# Altium schematic sheet Sheet1.SchDoc
size A3; SheetNumber: 1; SheetTotal: 1
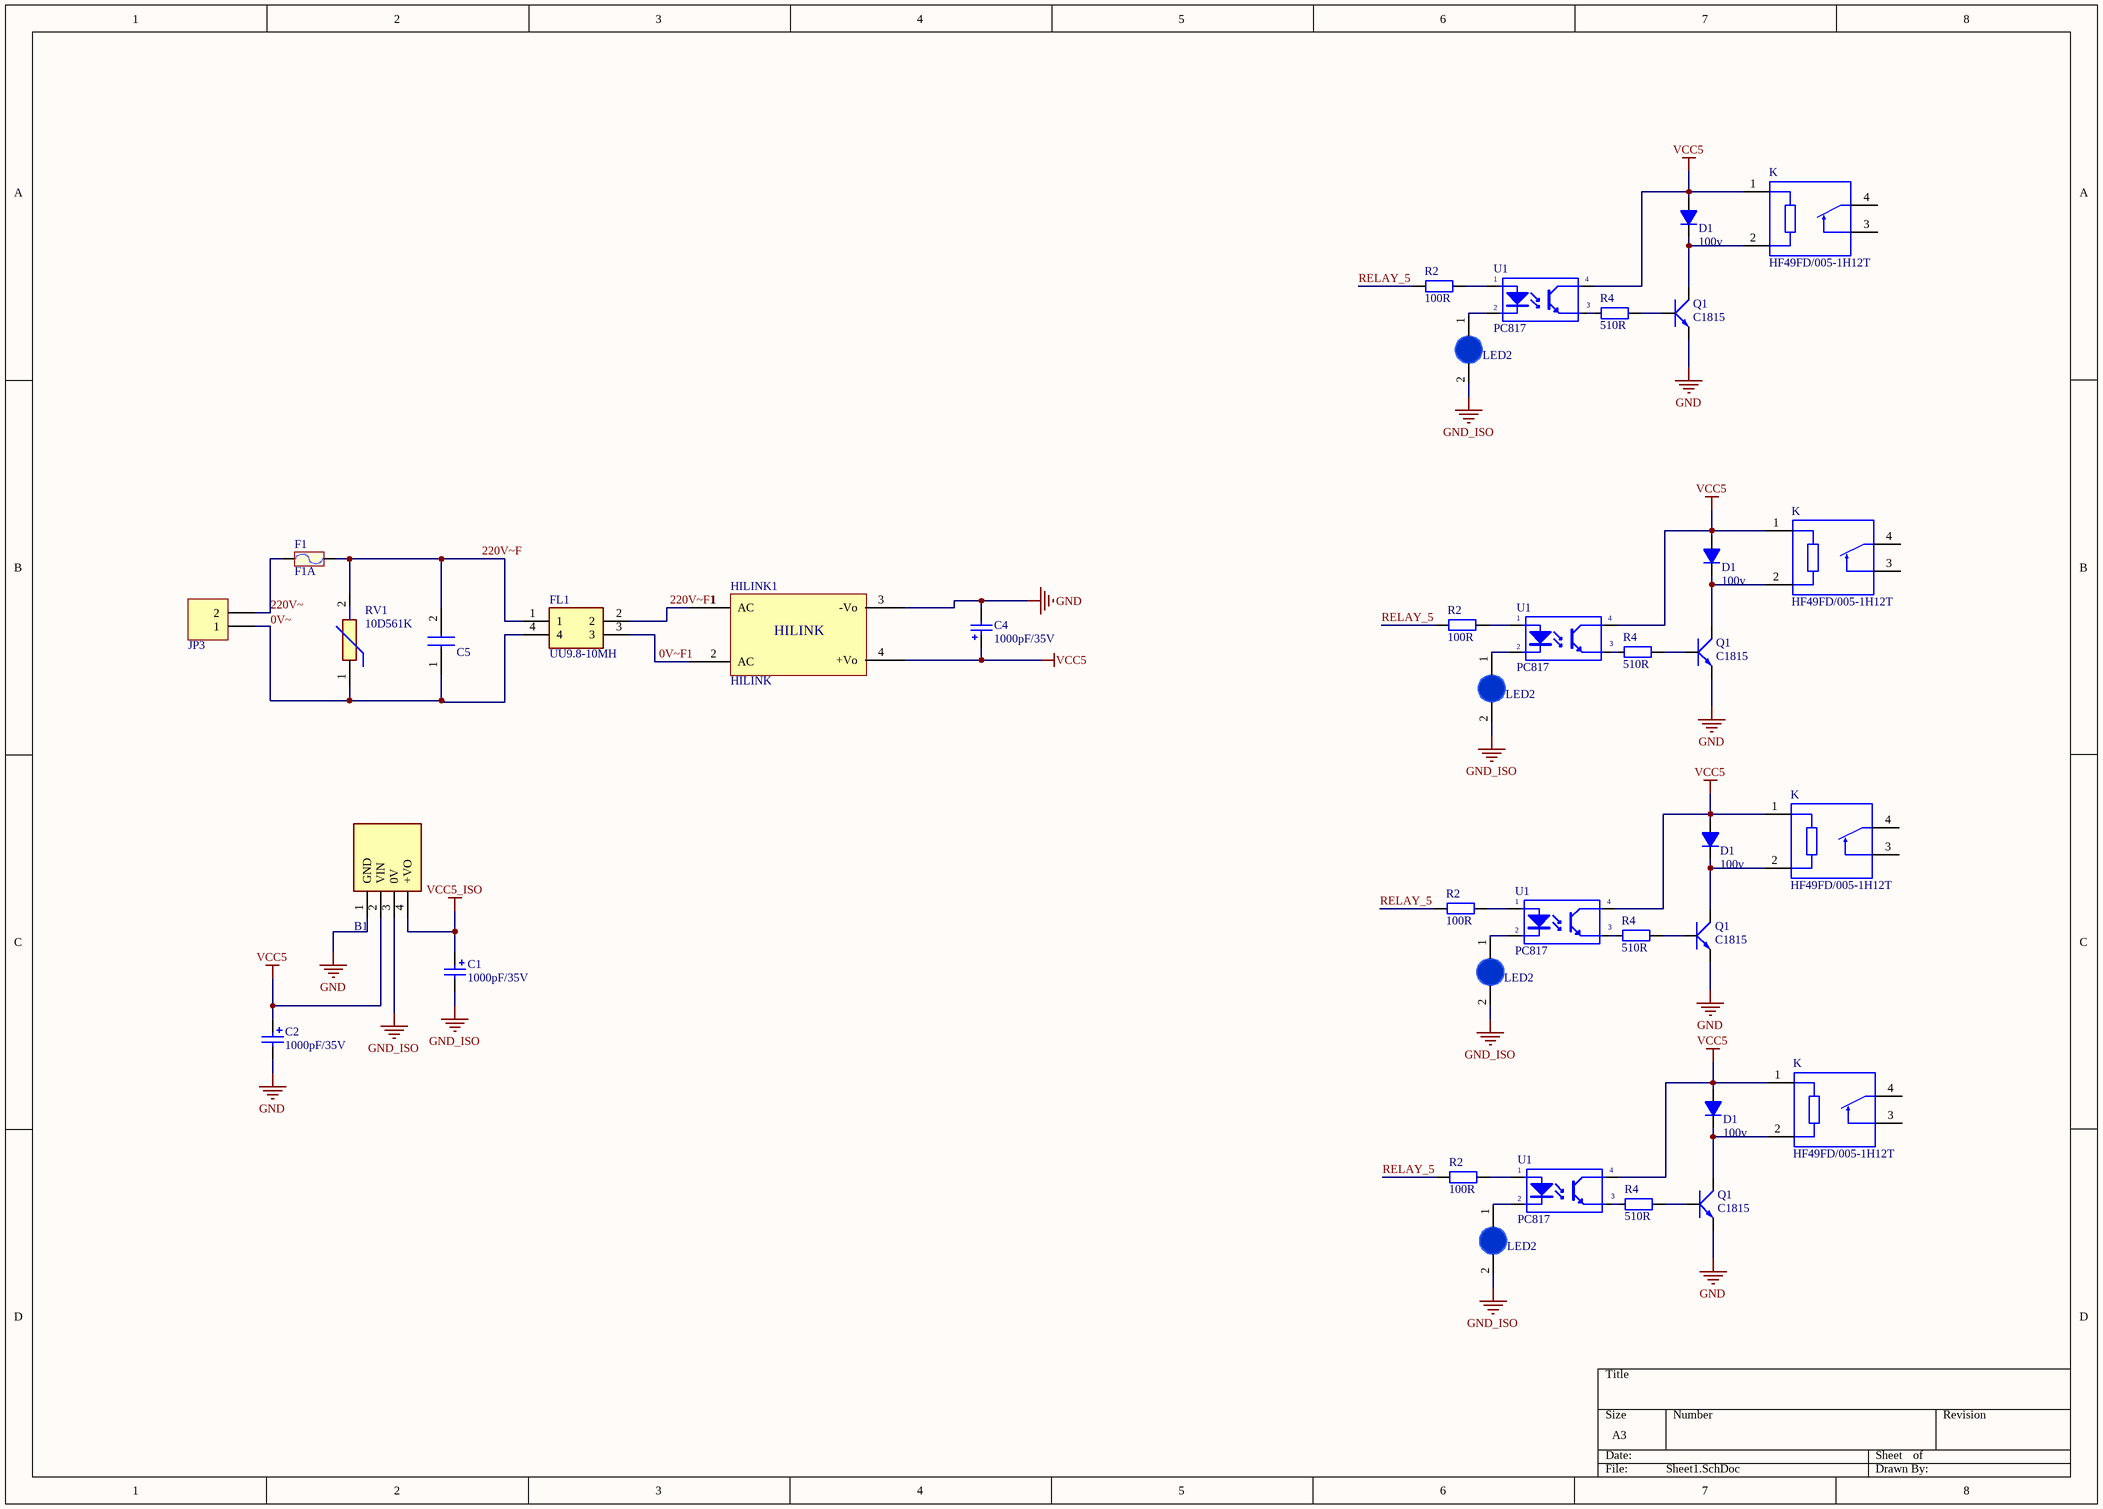
[diagram p0: Sheet1.SchDoc]

## Parts
(Parts that share a designator on the sheet are numbered #1, #2 ... from top to bottom, then left to right.)
B1  B0505S1W  [B0505S1W]  (value not drawn)
C1  value 1000pF/35V  [CP2/5]  (hidden comment: Cap Pol3)
C2  value 1000pF/35V  [CP2/5]  (hidden comment: Cap Pol3)
C4  value 1000pF/35V  [CP2/5]  (hidden comment: Cap Pol3)
C5  R46KF3100JMP0K  [R46KF3100JMP0K]  (value not drawn)
D1#1  100v  [DIODE 0.5A]
D1#2  100v  [DIODE 0.5A]
D1#3  100v  [DIODE 0.5A]
D1#4  100v  [DIODE 0.5A]
F1  F1A  [Fuse]
FL1  UU9.8-10MH  [UU9810MH]
HILINK1  HILINK  [HILINK_1W]
JP3  Header 2_1  [HED2]  (value not drawn)
K#1  HF49FD/005-1H12T  [RELAY_HF49FD/005-1H12T]
K#2  HF49FD/005-1H12T  [RELAY_HF49FD/005-1H12T]
K#3  HF49FD/005-1H12T  [RELAY_HF49FD/005-1H12T]
K#4  HF49FD/005-1H12T  [RELAY_HF49FD/005-1H12T]
LED2#1  LED 3mm  [LED-3MM-BLUE]  (value not drawn)
LED2#2  LED 3mm  [LED-3MM-BLUE]  (value not drawn)
LED2#3  LED 3mm  [LED-3MM-BLUE]  (value not drawn)
LED2#4  LED 3mm  [LED-3MM-BLUE]  (value not drawn)
Q1#1  C1815  [C1815_cam]
Q1#2  C1815  [C1815_cam]
Q1#3  C1815  [C1815_cam]
Q1#4  C1815  [C1815_cam]
R2#1  100R  [R1/4W]
R2#2  100R  [R1/4W]
R2#3  100R  [R1/4W]
R2#4  100R  [R1/4W]
R4#1  510R  [R1/4W]
R4#2  510R  [R1/4W]
R4#3  510R  [R1/4W]
R4#4  510R  [R1/4W]
RV1  10D561K  [10D561K]
U1#1  PC817  [DIP4/W0.3]
U1#2  PC817  [DIP4/W0.3]
U1#3  PC817  [DIP4/W0.3]
U1#4  PC817  [DIP4/W0.3]

## Nets
GND: B1.1(GND) C2.2 C4.2 HILINK1.3(-Vo) Q1#1.1(E) Q1#2.1(E) Q1#3.1(E) Q1#4.1(E)
GND_ISO: B1.3(0V) C1.2 LED2#1.2(K) LED2#2.2(K) LED2#3.2(K) LED2#4.2(K)
VCC5: B1.2(VIN) C2.1 C4.1 D1#1.1(A) D1#2.1(A) D1#3.1(A) D1#4.1(A) HILINK1.4(+Vo) K#1.1(L1) K#2.1(L1) K#3.1(L1) K#4.1(L1) U1#1.4(C) U1#2.4(C) U1#3.4(C) U1#4.4(C)
VCC5_ISO: B1.4(+VO) C1.1
0V~: C5.1 FL1.4 JP3.1 RV1.1
0V~F1: FL1.3 HILINK1.2(AC)
220V~: F1.1 JP3.2
220V~F: C5.2 F1.2 FL1.1 RV1.2
220V~F1: FL1.2 HILINK1.1(AC)
RELAY_5: R2#1.1 R2#2.1 R2#3.1 R2#4.1
NetD1#1_2: D1#1.2(K) K#1.2(L2) Q1#1.2(C)
NetD1#2_2: D1#2.2(K) K#2.2(L2) Q1#2.2(C)
NetD1#3_2: D1#3.2(K) K#3.2(L2) Q1#3.2(C)
NetD1#4_2: D1#4.2(K) K#4.2(L2) Q1#4.2(C)
NetLED2#1_1: LED2#1.1(A) U1#1.2(K)
NetLED2#2_1: LED2#2.1(A) U1#2.2(K)
NetLED2#3_1: LED2#3.1(A) U1#3.2(K)
NetLED2#4_1: LED2#4.1(A) U1#4.2(K)
NetQ1#1_3: Q1#1.3(B) R4#1.2
NetQ1#2_3: Q1#2.3(B) R4#2.2
NetQ1#3_3: Q1#3.3(B) R4#3.2
NetQ1#4_3: Q1#4.3(B) R4#4.2
NetR2#1_2: R2#1.2 U1#1.1(A)
NetR2#2_2: R2#2.2 U1#2.1(A)
NetR2#3_2: R2#3.2 U1#3.1(A)
NetR2#4_2: R2#4.2 U1#4.1(A)
NetR4#1_1: R4#1.1 U1#1.3(E)
NetR4#2_1: R4#2.1 U1#2.3(E)
NetR4#3_1: R4#3.1 U1#3.3(E)
NetR4#4_1: R4#4.1 U1#4.3(E)

Not connected (* = marked no-connect by the designer): K#1 3(C2) 4(C1); K#2 3(C2) 4(C1); K#3 3(C2) 4(C1); K#4 3(C2) 4(C1)

## Library data of the parts
B1 = B0505S1W: Power Supply; Manufacturer_Name: Mornsun; Manufacturer_Part_Number: B0505S-1W; Datasheet Link: https://www.mornsun-power.com/uploads/pdf/B_D-1W.pdf; Height: 10.41mm
C1 C2 C4 = Cap Pol3: Polarized Capacitor (Surface Mount); VALUE: C?; LatestRevisionDate: 17-Jul-2002; LatestRevisionNote: Re-released for DXP Platform.; PackageReference: C0805; Publisher: Altium Limited
C5 = R46KF3100JMP0K: Capacitor; Manufacturer_Name: Kemet; Datasheet Link: https://api.kemet.com/component-edge/download/specsheet/R46KF3100JMP0K.pdf; Height: 12.1mm; Manufacturer_Part_Number: R46KF3100JMP0K; Mouser Part Number: 80-R46KF3100JMP0K; Mouser Price/Stock: https://www.mouser.co.uk/ProductDetail/KEMET/R46KF3100JMP0K/?qs=gt1LBUVyoHk5JqGpZKIGRw%3D%3D
D1#1-D1#4 = Diode 1N4148: Cắm; Ten_Linh_Kien: Diode 1N4148 DO35 450mA 100V ( 1N4148 DIP); Don_Vi: Con; Ma_Hang: MH001065; Ghi Chu: *; Kieu_Chan: *; Chung_Loai: Cắm
F1 = Fuse: Designed by: VanDungEvn; Value: Fuse
FL1 = UU9.8-10MH: Filter; Manufacturer_Name: Guangdong Fenghua Advanced Tech; Datasheet Link: https://datasheet.lcsc.com/szlcsc/1811111206_Guangdong-Fenghua-Advanced-Tech-UU9-8-10mH_C148474.pdf; Height: 17mm; Manufacturer_Part_Number: UU9.8-10MH
JP3 = Header 2_1: Header, 2-Pin; Manufacturer: Generic Components; Class: Connector; Value: Header 2
K#1-K#4 = HF49FD/005-1H12T: Relay: electromagnetic; SPST-NO; Ucoil: 5VDC; 5A/250VAC; 5A/30VDC; MF: Hongfa; Price: None; SnapEDA_Link: https://www.snapeda.com/parts/HF49FD/005-1H12T/Hongfa/view-part/2753221/?ref=snap; MP: HF49FD/005-1H12T; Value: *; Availability: Unavailable; Package: None
LED2#1-LED2#4 = LED 3mm Xanh Duong: Cắm; Don_Vi: Con; Ma_Hang: MH009003; Ten_Linh_Kien: LED 3MM Xanh Dương SS (1000c); Ghi_Chu: *; Kieu_Chan: *; Chung_Loai: Cắm
Q1#1-Q1#4 = C1815: NPN 600mW, ECB; Value: C1815
R2#1-R2#4 R4#1-R4#4 = R1/4W: Resistor 1/4W; Value: R1/4W - 1K
RV1 = 10D561K: Varistor; Manufacturer_Name: Bourns; Manufacturer_Part_Number: MOV-10D561K; Datasheet Link: https://www.bourns.com/docs/Product-Datasheets/MOV10D.pdf; Height: 15.5mm; Mouser Part Number: 652-MOV-10D561K; Mouser Price/Stock: https://www.mouser.co.uk/ProductDetail/Bourns/MOV-10D561K?qs=lgttKnAd%252B2ArrqGQgWwr6w%3D%3D; Arrow Part Number: MOV-10D561K; Arrow Price/Stock: https://www.arrow.com/en/products/mov-10d561k/bourns
U1#1-U1#4 = PC817: Single Opto; Value: PC817